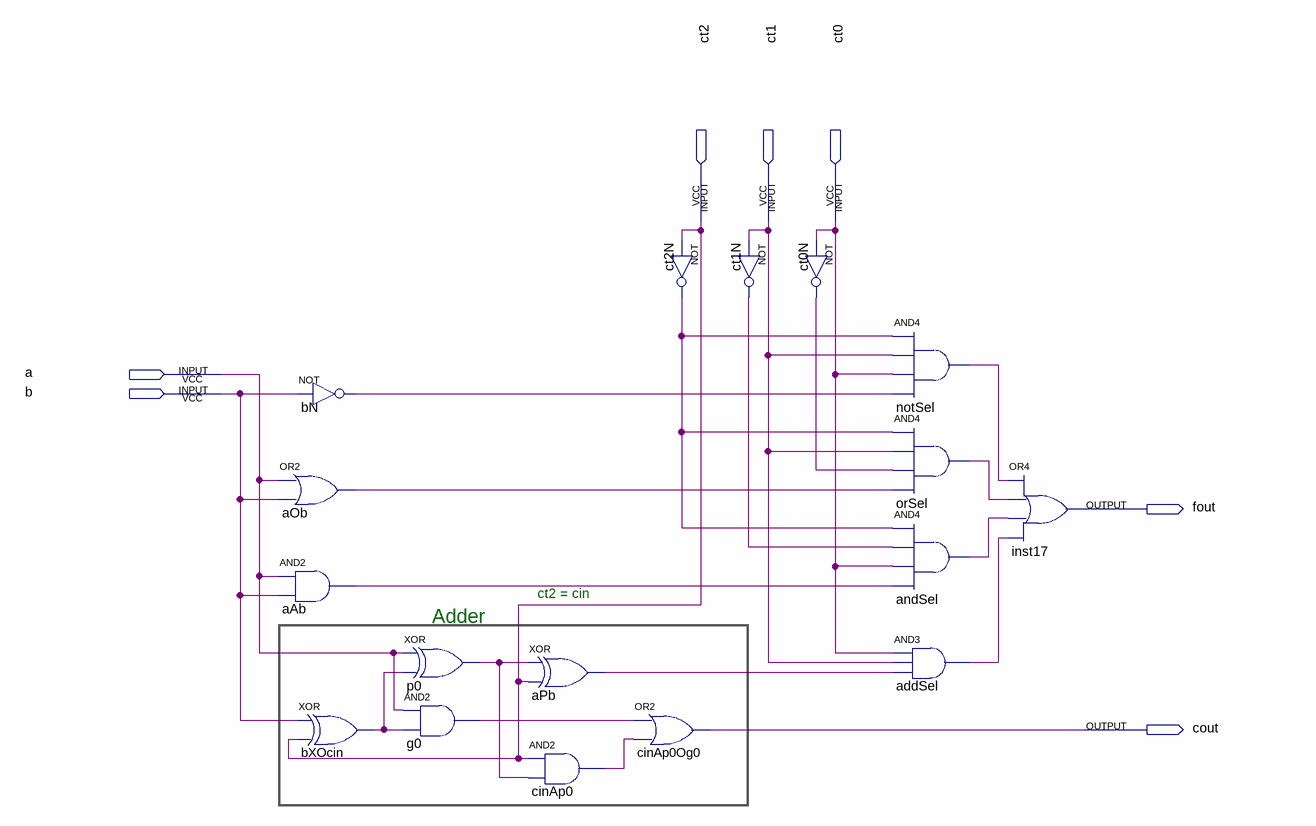
[diagram p0: schematic sheet]
// Quartus schematic OneBitALUGraphic.bdf as structural Verilog: 17 symbols, 7 pins
module OneBitALUGraphic (
  input  ct2,
  input  ct1,
  input  ct0,
  input  a,
  input  b,
  output fout,
  output cout
);

  wire aAb_out, addSel_out, andSel_out, aOb_out, aPb_out, bN_out, bXOcin_out, cinAp0_out, ct0N_out, ct1N_out,
       ct2N_out, g0_out, notSel_out, orSel_out, p0_out;

  not bN (bN_out, b);
  or aOb (aOb_out, a, b);
  and aAb (aAb_out, a, b);
  xor bXOcin (bXOcin_out, b, ct2);
  xor p0 (p0_out, a, bXOcin_out);
  and g0 (g0_out, a, bXOcin_out);
  xor aPb (aPb_out, p0_out, ct2);
  and cinAp0 (cinAp0_out, ct2, p0_out);
  or cinAp0Og0 (cout, g0_out, cinAp0_out);
  not ct2N (ct2N_out, ct2);
  not ct0N (ct0N_out, ct0);
  not ct1N (ct1N_out, ct1);
  and notSel (notSel_out, ct2N_out, ct1, ct0, bN_out);
  and orSel (orSel_out, ct2N_out, ct1, ct0N_out, aOb_out);
  and andSel (andSel_out, ct2N_out, ct1N_out, ct0, aAb_out);
  and addSel (addSel_out, ct0, ct1, aPb_out);
  or inst17 (fout, notSel_out, orSel_out, andSel_out, addSel_out);

  // Notes on the sheet:
  //   ct2 = cin
  //   Adder
endmodule
